# Altium schematic sheet Top.SchDoc
size C; Author: E. Sims; Organization: Let's Build Rockets Inc.; SheetNumber: 1; SheetTotal: 6
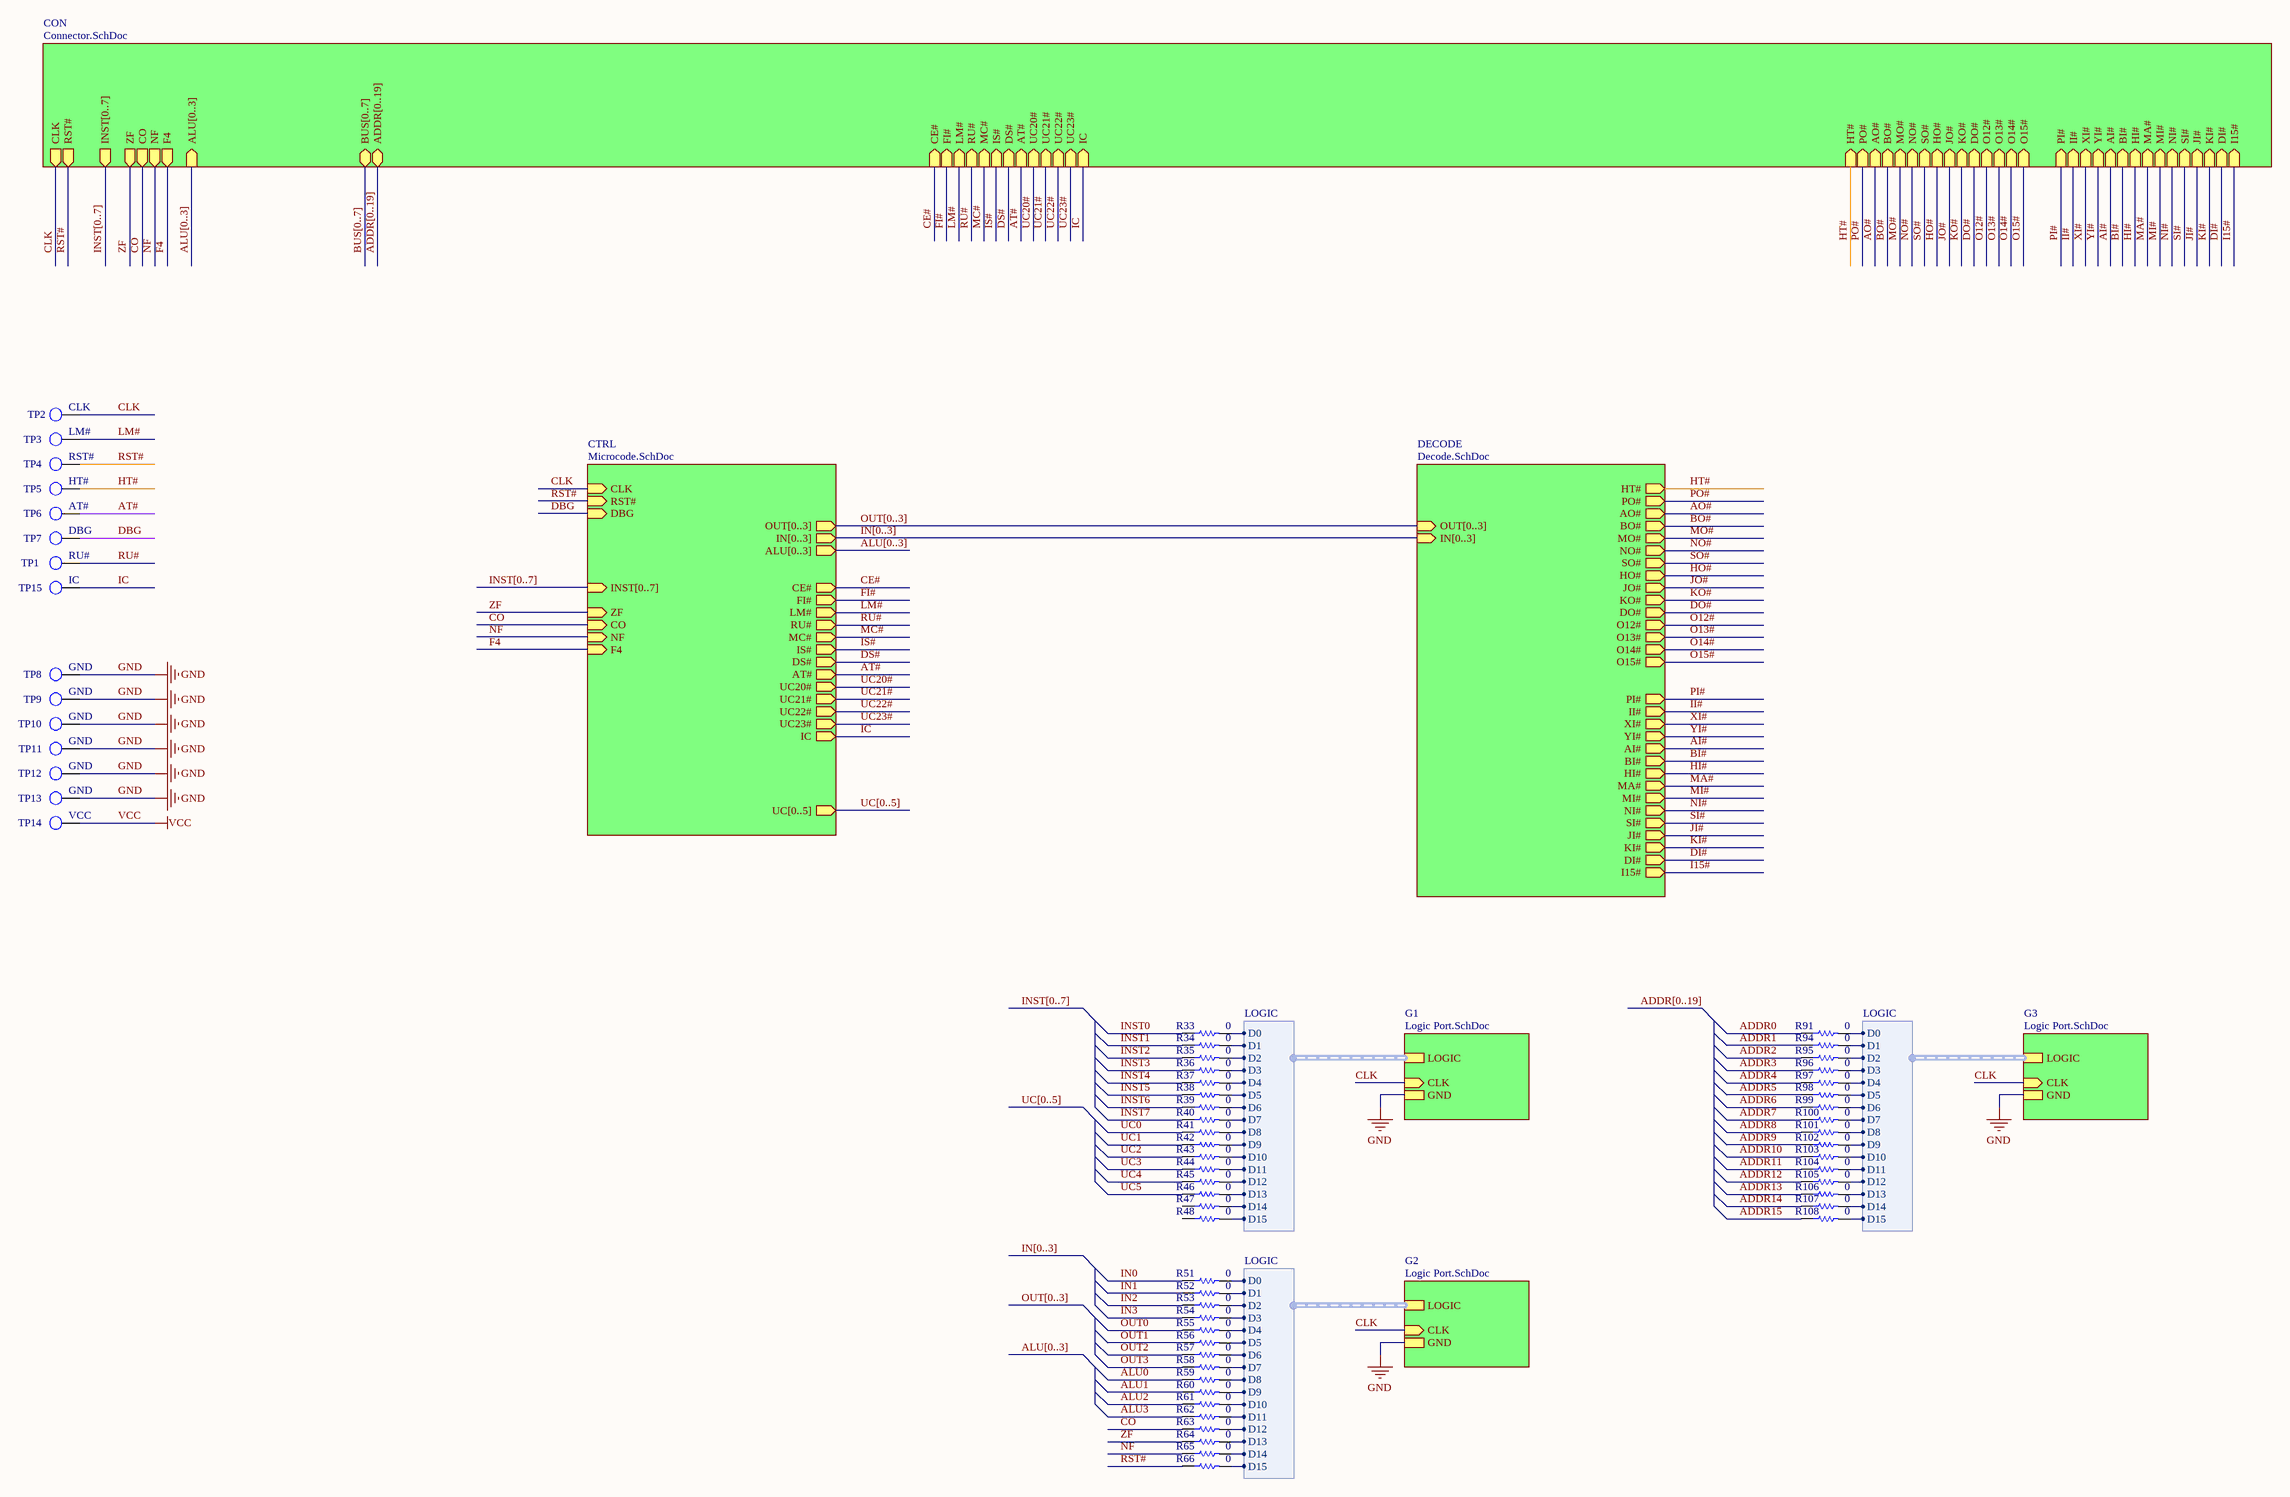
[diagram p0: Top.SchDoc]

## Parts
R33  value 0  [AXIAL-0.3]  (hidden comment: Res1)
R34  value 0  [AXIAL-0.3]  (hidden comment: Res1)
R35  value 0  [AXIAL-0.3]  (hidden comment: Res1)
R36  value 0  [AXIAL-0.3]  (hidden comment: Res1)
R37  value 0  [AXIAL-0.3]  (hidden comment: Res1)
R38  value 0  [AXIAL-0.3]  (hidden comment: Res1)
R39  value 0  [AXIAL-0.3]  (hidden comment: Res1)
R40  value 0  [AXIAL-0.3]  (hidden comment: Res1)
R41  value 0  [AXIAL-0.3]  (hidden comment: Res1)
R42  value 0  [AXIAL-0.3]  (hidden comment: Res1)
R43  value 0  [AXIAL-0.3]  (hidden comment: Res1)
R44  value 0  [AXIAL-0.3]  (hidden comment: Res1)
R45  value 0  [AXIAL-0.3]  (hidden comment: Res1)
R46  value 0  [AXIAL-0.3]  (hidden comment: Res1)
R47  value 0  [AXIAL-0.3]  (hidden comment: Res1)
R48  value 0  [AXIAL-0.3]  (hidden comment: Res1)
R51  value 0  [AXIAL-0.3]  (hidden comment: Res1)
R52  value 0  [AXIAL-0.3]  (hidden comment: Res1)
R53  value 0  [AXIAL-0.3]  (hidden comment: Res1)
R54  value 0  [AXIAL-0.3]  (hidden comment: Res1)
R55  value 0  [AXIAL-0.3]  (hidden comment: Res1)
R56  value 0  [AXIAL-0.3]  (hidden comment: Res1)
R57  value 0  [AXIAL-0.3]  (hidden comment: Res1)
R58  value 0  [AXIAL-0.3]  (hidden comment: Res1)
R59  value 0  [AXIAL-0.3]  (hidden comment: Res1)
R60  value 0  [AXIAL-0.3]  (hidden comment: Res1)
R61  value 0  [AXIAL-0.3]  (hidden comment: Res1)
R62  value 0  [AXIAL-0.3]  (hidden comment: Res1)
R63  value 0  [AXIAL-0.3]  (hidden comment: Res1)
R64  value 0  [AXIAL-0.3]  (hidden comment: Res1)
R65  value 0  [AXIAL-0.3]  (hidden comment: Res1)
R66  value 0  [AXIAL-0.3]  (hidden comment: Res1)
R91  value 0  [AXIAL-0.3]  (hidden comment: Res1)
R94  value 0  [AXIAL-0.3]  (hidden comment: Res1)
R95  value 0  [AXIAL-0.3]  (hidden comment: Res1)
R96  value 0  [AXIAL-0.3]  (hidden comment: Res1)
R97  value 0  [AXIAL-0.3]  (hidden comment: Res1)
R98  value 0  [AXIAL-0.3]  (hidden comment: Res1)
R99  value 0  [AXIAL-0.3]  (hidden comment: Res1)
R100  value 0  [AXIAL-0.3]  (hidden comment: Res1)
R101  value 0  [AXIAL-0.3]  (hidden comment: Res1)
R102  value 0  [AXIAL-0.3]  (hidden comment: Res1)
R103  value 0  [AXIAL-0.3]  (hidden comment: Res1)
R104  value 0  [AXIAL-0.3]  (hidden comment: Res1)
R105  value 0  [AXIAL-0.3]  (hidden comment: Res1)
R106  value 0  [AXIAL-0.3]  (hidden comment: Res1)
R107  value 0  [AXIAL-0.3]  (hidden comment: Res1)
R108  value 0  [AXIAL-0.3]  (hidden comment: Res1)
TP1  RU#  [KSTN-5011_V]  (no BOM)
TP2  CLK  [KSTN-5011_V]  (no BOM)
TP3  LM#  [KSTN-5011_V]  (no BOM)
TP4  RST#  [KSTN-5011_V]  (no BOM)
TP5  HT#  [KSTN-5011_V]  (no BOM)
TP6  AT#  [KSTN-5011_V]  (no BOM)
TP7  DBG  [KSTN-5011_V]  (no BOM)
TP8  GND  [KSTN-5011_V]  (no BOM)
TP9  GND  [KSTN-5011_V]  (no BOM)
TP10  GND  [KSTN-5011_V]  (no BOM)
TP11  GND  [KSTN-5011_V]  (no BOM)
TP12  GND  [KSTN-5011_V]  (no BOM)
TP13  GND  [KSTN-5011_V]  (no BOM)
TP14  VCC  [KSTN-5011_V]  (no BOM)
TP15  IC  [KSTN-5011_V]  (no BOM)

## Sub-sheets
CON = Connector.SchDoc: NF (out), RST# (out), CLK (out), ZF (out), INST[0..7] (out), CO (out), F4 (out), IS# (in), UC21# (in), RU# (in), AT# (in), MC# (in), CE# (in), IC (in), UC22# (in), DS# (in), FI# (in), UC23# (in), UC20# (in), LM# (in), PO# (in), HT# (in), NO# (in), JO# (in), BO# (in), O14# (in), SO# (in), O15# (in), KO# (in), DO# (in), AO# (in), O12# (in), O13# (in), MO# (in), HO# (in), I15# (in), JI# (in), SI# (in), PI# (in), XI# (in), MI# (in), HI# (in), II# (in), DI# (in), NI# (in), BI# (in), MA# (in), YI# (in), KI# (in), AI# (in), BUS[0..7] (bidir), ALU[0..3] (in), ADDR[0..19] (bidir)
CTRL = Microcode.SchDoc: NF (in), RST# (in), CLK (in), ZF (in), INST[0..7] (in), CO (in), UC[0..5] (out), IN[0..3] (out), ALU[0..3] (out), OUT[0..3] (out), IS# (out), UC21# (out), RU# (out), AT# (out), MC# (out), CE# (out), IC (out), UC22# (out), DS# (out), FI# (out), UC23# (out), UC20# (out), LM# (out), F4 (in), DBG (in)
DECODE = Decode.SchDoc: IN[0..3] (in), OUT[0..3] (in), PO# (out), HT# (out), NO# (out), JO# (out), BO# (out), O14# (out), SO# (out), O15# (out), KO# (out), DO# (out), AO# (out), O12# (out), O13# (out), MO# (out), HO# (out), I15# (out), JI# (out), SI# (out), PI# (out), XI# (out), MI# (out), HI# (out), II# (out), DI# (out), NI# (out), BI# (out), MA# (out), YI# (out), KI# (out), AI# (out)
G1 = Logic Port.SchDoc: GND, CLK (in), LOGIC (harness LOGIC)
G2 = Logic Port.SchDoc: GND, CLK (in), LOGIC (harness LOGIC)
G3 = Logic Port.SchDoc: GND, CLK (in), LOGIC (harness LOGIC)

## Harnesses
LOGIC: D0, D1, D2, D3, D4, D5, D6, D7, D8, D9, D10, D11, D12, D13, D14, D15

## Nets
GND: TP8.1 TP9.1 TP10.1 TP11.1 TP12.1 TP13.1 ; sheet G1/GND, sheet G2/GND, sheet G3/GND
VCC: TP14.1
ADDR0: R91.1
ADDR1: R94.1
ADDR2: R95.1
ADDR3: R96.1
ADDR4: R97.1
ADDR5: R98.1
ADDR6: R99.1
ADDR7: R100.1
ADDR8: R101.1
ADDR9: R102.1
ADDR10: R103.1
ADDR11: R104.1
ADDR12: R105.1
ADDR13: R106.1
ADDR14: R107.1
ADDR15: R108.1
AI#: sheet DECODE/AI#, sheet CON/AI#
ALU0: R59.1
ALU1: R60.1
ALU2: R61.1
ALU3: R62.1
AO#: sheet DECODE/AO#, sheet CON/AO#
AT#: TP6.1 ; sheet CTRL/AT#, sheet CON/AT#
BI#: sheet DECODE/BI#, sheet CON/BI#
BO#: sheet DECODE/BO#, sheet CON/BO#
CE#: sheet CTRL/CE#, sheet CON/CE#
CLK: TP2.1 ; sheet CTRL/CLK, sheet G1/CLK, sheet G2/CLK, sheet CON/CLK, sheet G3/CLK
CO: R63.1 ; sheet CTRL/CO, sheet CON/CO
DBG: TP7.1 ; sheet CTRL/DBG
DI#: sheet DECODE/DI#, sheet CON/DI#
DO#: sheet DECODE/DO#, sheet CON/DO#
DS#: sheet CTRL/DS#, sheet CON/DS#
F4: sheet CTRL/F4, sheet CON/F4
FI#: sheet CTRL/FI#, sheet CON/FI#
HI#: sheet DECODE/HI#, sheet CON/HI#
HO#: sheet DECODE/HO#, sheet CON/HO#
HT#: TP5.1 ; sheet DECODE/HT#, sheet CON/HT#
I15#: sheet DECODE/I15#, sheet CON/I15#
IC: TP15.1 ; sheet CTRL/IC, sheet CON/IC
II#: sheet DECODE/II#, sheet CON/II#
IN0: R51.1
IN1: R52.1
IN2: R53.1
IN3: R54.1
INST0: R33.1
INST1: R34.1
INST2: R35.1
INST3: R36.1
INST4: R37.1
INST5: R38.1
INST6: R39.1
INST7: R40.1
IS#: sheet CTRL/IS#, sheet CON/IS#
JI#: sheet DECODE/JI#, sheet CON/JI#
JO#: sheet DECODE/JO#, sheet CON/JO#
KI#: sheet DECODE/KI#, sheet CON/KI#
KO#: sheet DECODE/KO#, sheet CON/KO#
LM#: TP3.1 ; sheet CTRL/LM#, sheet CON/LM#
MA#: sheet DECODE/MA#, sheet CON/MA#
MC#: sheet CTRL/MC#, sheet CON/MC#
MI#: sheet DECODE/MI#, sheet CON/MI#
MO#: sheet DECODE/MO#, sheet CON/MO#
NF: R65.1 ; sheet CTRL/NF, sheet CON/NF
NI#: sheet DECODE/NI#, sheet CON/NI#
NO#: sheet DECODE/NO#, sheet CON/NO#
O12#: sheet DECODE/O12#, sheet CON/O12#
O13#: sheet DECODE/O13#, sheet CON/O13#
O14#: sheet DECODE/O14#, sheet CON/O14#
O15#: sheet DECODE/O15#, sheet CON/O15#
OUT0: R55.1
OUT1: R56.1
OUT2: R57.1
OUT3: R58.1
PI#: sheet DECODE/PI#, sheet CON/PI#
PO#: sheet DECODE/PO#, sheet CON/PO#
RST#: R66.1 TP4.1 ; sheet CTRL/RST#, sheet CON/RST#
RU#: TP1.1 ; sheet CTRL/RU#, sheet CON/RU#
SI#: sheet DECODE/SI#, sheet CON/SI#
SO#: sheet DECODE/SO#, sheet CON/SO#
UC0: R41.1
UC1: R42.1
UC2: R43.1
UC3: R44.1
UC4: R45.1
UC5: R46.1
UC20#: sheet CTRL/UC20#, sheet CON/UC20#
UC21#: sheet CTRL/UC21#, sheet CON/UC21#
UC22#: sheet CTRL/UC22#, sheet CON/UC22#
UC23#: sheet CTRL/UC23#, sheet CON/UC23#
XI#: sheet DECODE/XI#, sheet CON/XI#
YI#: sheet DECODE/YI#, sheet CON/YI#
ZF: R64.1 ; sheet CTRL/ZF, sheet CON/ZF
NetR33_2: R33.2 ; sheet G1/LOGIC.D0
NetR34_2: R34.2 ; sheet G1/LOGIC.D1
NetR35_2: R35.2 ; sheet G1/LOGIC.D2
NetR36_2: R36.2 ; sheet G1/LOGIC.D3
NetR37_2: R37.2 ; sheet G1/LOGIC.D4
NetR38_2: R38.2 ; sheet G1/LOGIC.D5
NetR39_2: R39.2 ; sheet G1/LOGIC.D6
NetR40_2: R40.2 ; sheet G1/LOGIC.D7
NetR41_2: R41.2 ; sheet G1/LOGIC.D8
NetR42_2: R42.2 ; sheet G1/LOGIC.D9
NetR43_2: R43.2 ; sheet G1/LOGIC.D10
NetR44_2: R44.2 ; sheet G1/LOGIC.D11
NetR45_2: R45.2 ; sheet G1/LOGIC.D12
NetR46_2: R46.2 ; sheet G1/LOGIC.D13
NetR47_2: R47.2 ; sheet G1/LOGIC.D14
NetR48_2: R48.2 ; sheet G1/LOGIC.D15
NetR51_2: R51.2 ; sheet G2/LOGIC.D0
NetR52_2: R52.2 ; sheet G2/LOGIC.D1
NetR53_2: R53.2 ; sheet G2/LOGIC.D2
NetR54_2: R54.2 ; sheet G2/LOGIC.D3
NetR55_2: R55.2 ; sheet G2/LOGIC.D4
NetR56_2: R56.2 ; sheet G2/LOGIC.D5
NetR57_2: R57.2 ; sheet G2/LOGIC.D6
NetR58_2: R58.2 ; sheet G2/LOGIC.D7
NetR59_2: R59.2 ; sheet G2/LOGIC.D8
NetR60_2: R60.2 ; sheet G2/LOGIC.D9
NetR61_2: R61.2 ; sheet G2/LOGIC.D10
NetR62_2: R62.2 ; sheet G2/LOGIC.D11
NetR63_2: R63.2 ; sheet G2/LOGIC.D12
NetR64_2: R64.2 ; sheet G2/LOGIC.D13
NetR65_2: R65.2 ; sheet G2/LOGIC.D14
NetR66_2: R66.2 ; sheet G2/LOGIC.D15
NetR91_2: R91.2 ; sheet G3/LOGIC.D0
NetR94_2: R94.2 ; sheet G3/LOGIC.D1
NetR95_2: R95.2 ; sheet G3/LOGIC.D2
NetR96_2: R96.2 ; sheet G3/LOGIC.D3
NetR97_2: R97.2 ; sheet G3/LOGIC.D4
NetR98_2: R98.2 ; sheet G3/LOGIC.D5
NetR99_2: R99.2 ; sheet G3/LOGIC.D6
NetR100_2: R100.2 ; sheet G3/LOGIC.D7
NetR101_2: R101.2 ; sheet G3/LOGIC.D8
NetR102_2: R102.2 ; sheet G3/LOGIC.D9
NetR103_2: R103.2 ; sheet G3/LOGIC.D10
NetR104_2: R104.2 ; sheet G3/LOGIC.D11
NetR105_2: R105.2 ; sheet G3/LOGIC.D12
NetR106_2: R106.2 ; sheet G3/LOGIC.D13
NetR107_2: R107.2 ; sheet G3/LOGIC.D14
NetR108_2: R108.2 ; sheet G3/LOGIC.D15

Not connected (* = marked no-connect by the designer): R47 1; R48 1

## Buses and harness runs
bus ADDR[0..19]
bus ADDR[0..19] = sheet CON/ADDR[0..19]
bus ALU[0..3]
bus ALU[0..3] = sheet CON/ALU[0..3]
bus ALU[0..3] = sheet CTRL/ALU[0..3]
bus BUS[0..7] = sheet CON/BUS[0..7]
bus IN[0..3]
bus IN[0..3] = sheet CTRL/IN[0..3] = sheet DECODE/IN[0..3]
bus INST[0..7]
bus INST[0..7] = sheet CON/INST[0..7]
bus INST[0..7] = sheet CTRL/INST[0..7]
bus OUT[0..3]
bus OUT[0..3] = sheet CTRL/OUT[0..3] = sheet DECODE/OUT[0..3]
bus UC[0..5]
bus UC[0..5] = sheet CTRL/UC[0..5]

## Notes on the sheet
- Let's Build Rocket's Inc. Modular Paylaod System Based on TMP-010 Rev
  For more information visit https://github.com/LetsBuildRockets/Modular-Payload-System
  This work is licensed under CC BY-NC 4.0. To view a copy of this license, visit https://creativecommons.org/licenses/by-nc/4.0
- Title
- Size:
- Date:
- Assembly Variant:
- B
- Number:
- Time:
- Revision:
- Sheet
- of
- Author:
- File:

## Library data of the parts
R33-R48 R51-R66 R91 R94-R108 = Res1: Resistor; Published: 8-Jun-2000; LatestRevisionDate: 17-Jul-2002; LatestRevisionNote: Re-released for DXP Platform.; PackageReference: AXIAL-0.3; Publisher: Altium Limited; PackageDescription: Axial Device, Thru-Hole; 2 Leads; 0.3 in Pin Spacing
TP1-TP15 = TP